# EAGLE design led_stripe_pwm (EAGLE 6.6.0)
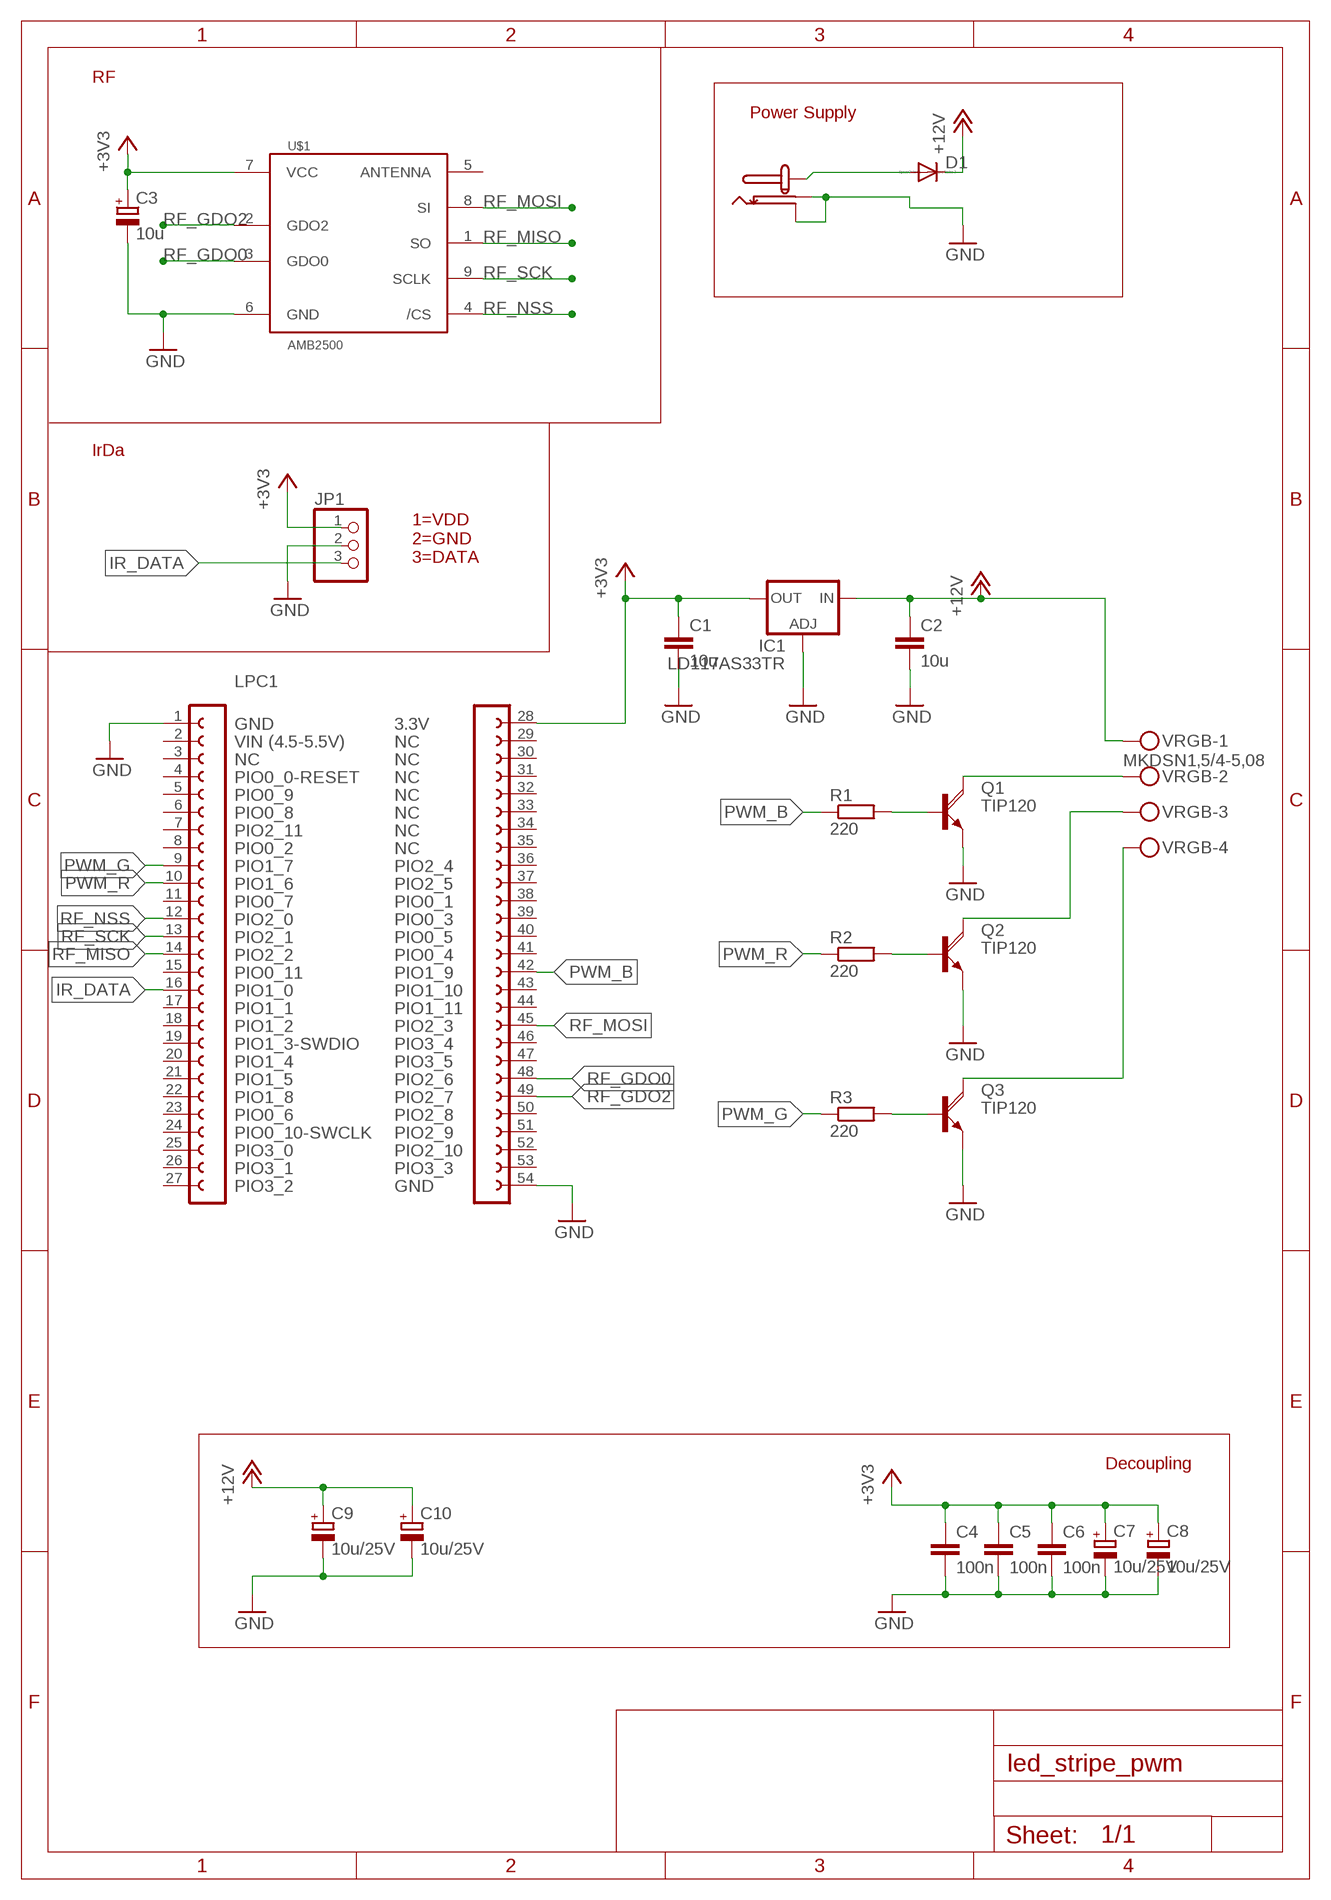
[diagram p0: schematic, sheet 1]

## Parts
C1  10u  C-EUC0805K  [C0805K]
C2  10u  C-EUC0805K  [C0805K]
C3  10u  CPOL-EUA/3216-18W  [A/3216-18W]
C4  100n  C-EUC0805  [C0805]
C5  100n  C-EUC0805  [C0805]
C6  100n  C-EUC0805  [C0805]
C7  10u/25V  CPOL-EUB  [PANASONIC_B]
C8  10u/25V  CPOL-EUB  [PANASONIC_B]
C9  10u/25V  CPOL-EUB  [PANASONIC_B]
C10  10u/25V  CPOL-EUB  [PANASONIC_B]
D1  DIODE-DO201-15  [DO201-15]
IC1  LD117AS33TR  [SOT223]
JP1  PINHD-1X3  [1X03]
LPC1  LPCXPRESSO_LPC1114  [LPCXPRESSO_LPC1114]
Q1  TIP120  [TO220AH]
Q2  TIP120  [TO220AH]
Q3  TIP120  [TO220AH]
R1  220  R-EU_R0805  [R0805]
R2  220  R-EU_R0805  [R0805]
R3  220  R-EU_R0805  [R0805]
U$1  AMB2500  AMB8400  [AMB8400]
U$2  DC_JACK  [DC_JACK_21]
VRGB  MKDSN1,5/4-5,08  [MKDSN1,5/4-5,08]

## Nets
+3V3: C1.1 C3.+ C4.1 C5.1 C6.1 C7.+ C8.+ IC1.4(OUT) JP1.1 LPC1.28 U$1.7(VCC)
+12V: C2.1 C9.+ C10.+ D1.C IC1.3(IN) VRGB.1
GND: C1.2 C2.2 C3.- C4.2 C5.2 C6.2 C7.- C8.- C9.- C10.- IC1.1(ADJ) JP1.2 LPC1.1 LPC1.54 Q1.E Q2.E Q3.E U$1.6(GND) U$2.P$2 U$2.P$3
IR_DATA: JP1.3 LPC1.16
N$1: Q1.B R1.2
N$2: Q2.B R2.2
N$3: Q3.B R3.2
N$4: Q2.C VRGB.3
N$5: Q1.C VRGB.2
N$6: Q3.C VRGB.4
N$7: D1.A U$2.P$1
PWM_B: LPC1.42 R1.1
PWM_G: LPC1.9 R3.1
PWM_R: LPC1.10 R2.1
RF_GDO0: LPC1.48 U$1.3(GDO0)
RF_GDO2: LPC1.49 U$1.2(GDO2)
RF_MISO: LPC1.14 U$1.1(SO)
RF_MOSI: LPC1.45 U$1.8(SI)
RF_NSS: LPC1.12 U$1.4(/CS)
RF_SCK: LPC1.13 U$1.9(SCLK)
Unconnected: LPC1.2 LPC1.3 LPC1.4 LPC1.5 LPC1.6 LPC1.7 LPC1.8 LPC1.11 LPC1.15 LPC1.17 LPC1.18 LPC1.19 LPC1.20 LPC1.21 LPC1.22 LPC1.23 LPC1.24 LPC1.25 LPC1.26 LPC1.27 LPC1.29 LPC1.30 LPC1.31 LPC1.32 LPC1.33 LPC1.34 LPC1.35 LPC1.36 LPC1.37 LPC1.38 LPC1.39 LPC1.40 LPC1.41 LPC1.43 LPC1.44 LPC1.46 LPC1.47 LPC1.50 LPC1.51 LPC1.52 LPC1.53 U$1.5(ANTENNA)

## Notes on the sheet
- RF
- Power Supply
- IrDa
- 1=VDD
  2=GND
  3=DATA
- Decoupling

## Library data of the parts
C1 C2 C4-C6 = rcl:C-EU: CAPACITOR, European symbol
C3 C7-C10 = rcl:CPOL-EU: POLARIZED CAPACITOR, European symbol
D1 = diode:DIODE-: DIODE
IC1 = v-reg:LD117A?*: Low drop fixed and adjustable positive voltage regulators 1 A Source: http://www.st.com/stonline/products/literature/ds/7194/ld1117axx.pdf
JP1 = pinhead:PINHD-1X3: PIN HEADER
LPC1 = LPCXpresso_boards:LPCXPRESSO_LPC1114
Q1-Q3 = transistor-power:TIP120: NPN DARLINGTON TRANSISTOR
R1-R3 = rcl:R-EU_: RESISTOR, European symbol
U$1 = Amber-Wireless:AMB8400
U$2 = DC_Jack_Cliff_FC681465P:DC_JACK
VRGB = con-phoenix-508:MKDSN1,5/4-5,08: MKDSN 1,5/ 4-5,08 Printklemme Nennstrom: 13,5 A Nennspannung: 250 V Rastermaß: 5,08 mm Polzahl: 4 Anschlussart: Schraubanschluss Montage: Löten Anschlussrichtung Leiter/Platine: 0 ° Artikelnummer: 1729144 Source: http://eshop.phoenixcontact.com .. 1729144.pdf

## Board
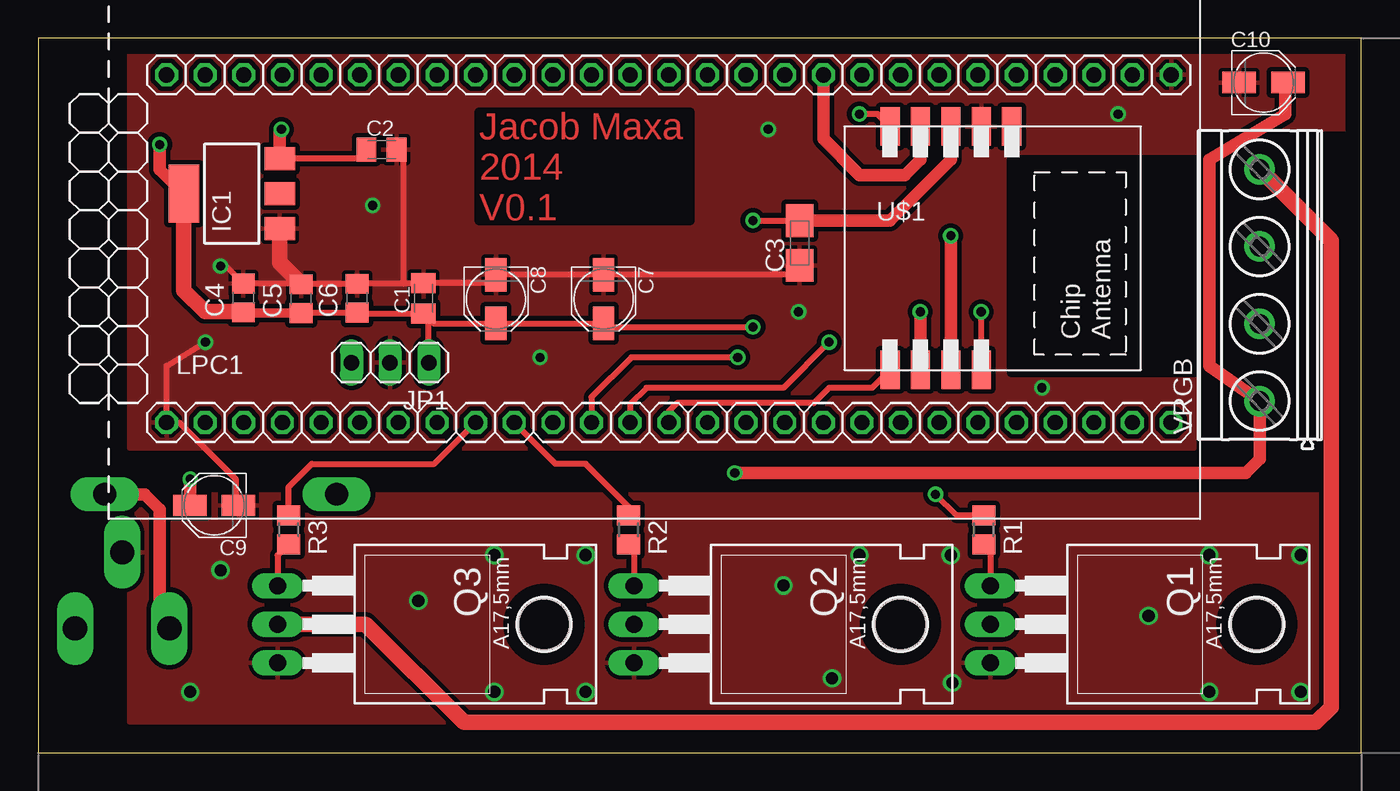
[diagram p1: board, top side]
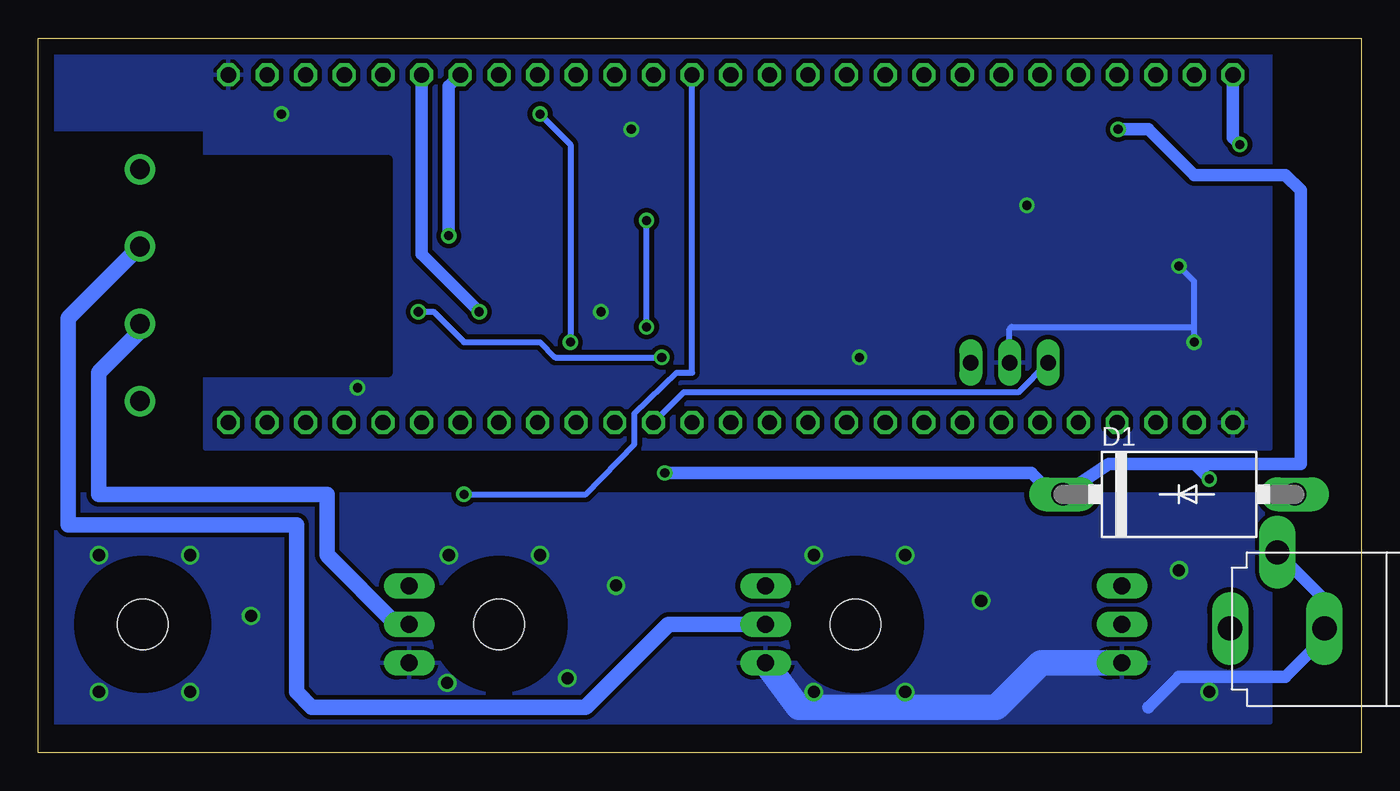
[diagram p2: board, bottom side, seen from below]

Size 87 x 47 mm. Coordinates in mm from the lower left corner, seen from the top.
Outline: 0,0 87,0 87,47 0,47 0,0
Copper layers (1*16): Top 0.035mm / dielectric 1.5mm / Bottom 0.035mm
Design rules "default": minimum track width 10mil, minimum drill 24mil, track to track 8mil, track to pad 8mil, pad to pad 8mil, via to via 8mil, smd to smd 8mil, copper to edge 40mil, drill to drill 8mil, minimum pad ring 10mil, minimum via ring 8mil, stop-mask expansion 4mil, vias tented up to drill 0mil, thermal gap 10mil
tRestrict: area 64,25 to 73,39; area 73,25 to 76,39
bRestrict: area 64,25 to 73,39; area 73,25 to 76,39

### Footprints (pad centres in the part's own frame; a part is rotated, then mirrored left to right if it is on the bottom)
C0805K = smd 1.3 x 1.6: 1 -1,0; 2 1,0
A/3216-18W = smd 2.15 x 1.8: + 1.475,0; - -1.475,0
C0805 = smd 1.3 x 1.5: 1 -0.95,0; 2 0.95,0
PANASONIC_B = smd 2.2 x 1.4: + 1.6,0; - -1.6,0
DO201-15 = drill 1.499 long: A 7.62,0; C -7.62,0
SOT223 = smd 1.5 x 2: 1 -2.3,-3.15; 2 0,-3.15; 3 2.3,-3.15 | smd 3.8 x 2: 4 0,3.15
1X03 = drill 1.016 long: 1 -2.54,0; 2 0,0; 3 2.54,0
LPCXPRESSO_LPC1114 = drill 1 octagon: 1 33.655,-5.715; 2 36.195,-5.715; 3 38.735,-5.715; 4 41.275,-5.715; 5 43.815,-5.715; 6 46.355,-5.715; 7 48.895,-5.715; 8 51.435,-5.715; 9 53.975,-5.715; 10 56.515,-5.715; 11 59.055,-5.715; 12 61.595,-5.715; 13 64.135,-5.715; 14 66.675,-5.715; 15 69.215,-5.715; 16 71.755,-5.715; 17 74.295,-5.715; 18 76.835,-5.715; 19 79.375,-5.715; 20 81.915,-5.715; 21 84.455,-5.715; 22 86.995,-5.715; 23 89.535,-5.715; 24 92.075,-5.715; 25 94.615,-5.715; 26 97.155,-5.715; 27 99.695,-5.715; 28 33.655,17.145; 29 36.195,17.145; 30 38.735,17.145; 31 41.275,17.145; 32 43.815,17.145; 33 46.355,17.145; 34 48.895,17.145; 35 51.435,17.145; 36 53.975,17.145; 37 56.515,17.145; 38 59.055,17.145; 39 61.595,17.145; 40 64.135,17.145; 41 66.675,17.145; 42 69.215,17.145; 43 71.755,17.145; 44 74.295,17.145; 45 76.835,17.145; 46 79.375,17.145; 47 81.915,17.145; 48 84.455,17.145; 49 86.995,17.145; 50 89.535,17.145; 51 92.075,17.145; 52 94.615,17.145; 53 97.155,17.145; 54 99.695,17.145
TO220AH = drill 1.118 long: B -2.54,-6.35; C 0,-6.35; E 2.54,-6.35 | hole 3.302: 0,11.176
R0805 = smd 1.3 x 1.5: 1 -0.95,0; 2 0.95,0
AMB8400 = smd 1.27 x 2.54: 1 -1.77,-8; 2 0.23,-8; 3 2.23,-8; 4 4.23,-8; 5 6.23,8; 6 4.23,8; 7 2.23,8; 8 0.23,8; 9 -1.77,8
DC_JACK_21 = drill 1.6 long: P$1 0.02,-0.08; P$2 -3.08,-5.08; P$3 -6.18,-0.08
MKDSN1,5/4-5,08 = drill 1.3 pad 2: 1 -7.641,0.025; 2 -2.561,0.025; 3 2.519,0.025; 4 7.599,0.025

### Placement (x,y rotation side)
C1  25.34,29.89 90 top
C2  22.58,39.66 0 top
C3  50.07,33.52 90 top
C4  13.5,29.91 90 top
C5  17.3,29.86 90 top
C6  20.97,29.89 90 top
C7  37.18,29.83 270 top
C8  30.1,29.83 270 top
C9  11.58,16.27 180 top
C10  80.56,44.07 0 top
D1  12,17 0 bottom
IC1  12.74,36.77 90 top
JP1  23.14,25.66 180 top
LPC1  -25.21,27.43 0 top
Q1  68.95,8.45 270 top
Q2  45.52,8.45 270 top
Q3  22.09,8.45 270 top
R1  62.17,14.66 270 top
R2  38.82,14.66 270 top
R3  16.47,14.66 270 top
U$1  57.78,33.18 0 top
U$2  8.61,8.1 180 bottom
VRGB  80.33,30.77 90 top

### Tracks (layer width: path | path; a pad name or v marks a point on that pad's centre or on a via)
+3V3  (via drill 0.6)
  Top 0.406: C5.1 17.33,28.94 C6.1 21.02,28.89 C1.1 | C1.1 26,28.23 C8.+ C7.+ 37.41,28 v47,28 | v47,35 v47.01,34.99 C3.+ | JP1.1 25.68,28.55 C1.1
  Top 0.61: C4.1 13.55,28.91 C5.1
  Top 0.813: C3.+ 56,35 60,39 60,41 60.01,41.01 U$1.7 | IC1.4 8,38.36 v8,40
  Top 1.016: IC1.4 9.59,30.41 11,29 13.46,29 C4.1
  Bottom 0.406: v47,28 v47,35
  Bottom 0.813: v8,40 8.45,40.45 LPC1.28
+12V  (via drill 0.6)
  Top 0.406: C2.1 20.99,39.07 IC1.3 | C10.+ 82,43.91 82,42
  Top 0.813: 82,44 82,42 77,39 77,25.43 VRGB.1 80.31,19.3 79.4,18.4 v45.8,18.4 | C9.+ 10,16.29 v10,18 | v16,41 15.89,40.89 IC1.3
  Bottom 0.813: v10,18 11,19 | v45.8,18.4 21.7,18.4 20.3,17 D1.C 16.62,19 11,19 | 11,19 4,19 4,37 5,38 11,38 14,41 v16,41
GND  (via drill 0.6, 0.8)
  Top 0.406: C3.- 49.45,31.43 C7.- C8.- 29.56,30.89 C1.2 25.29,30.84 24,30.84 | 24,30.84 C6.2 20.94,30.81 C5.2 17.25,30.86 C4.2 12.36,32 v12,32 | C2.2 24,39.24 24,30.84 | v11,27 8.45,25.45 LPC1.1 9.29,21.71 13,18 13,16.45 C9.- | C10.- 78.45,44.58
  Top 1.016: IC1.1 15.89,32.22 C5.2
  Bottom 0.406: v11,27 11,28 | 11,28 11,31 v12,32 | JP1.2 23.14,27.86 23,28 11,28
  Bottom 0.813: 14,3 12,5 5,5 2.43,7.57 U$2.P$3 2.43,10.08 U$2.P$2
  Bottom 1.676: Q3.E 21.09,5.91 24,3 37,3 Q2.E
  other vias: 71,42 66,24 48,41 50,29 33,26 22,36 30,13 36,13 30,4 36,4 54,13 60,13 60.1,4.6 52.2,4.9 77,4 77,13 83,13 83,4 73,9 49,11 25,10 12,12 10,4
  pour Bottom (isolate 0.305): 6,46 86,46 86,41 76,41 76,20 6,20
  pour Top (isolate 0.305): 6,46 86,46 86,41 76,41 76,20 6,20
  pour Bottom (isolate 0.305): 6,2 86,2 86,17 6,17
  pour Top (isolate 0.305): 6,2 86,2 86,17 6,17
IR_DATA
  Bottom 0.406: JP1.3 22.56,23.7 44.56,23.7 LPC1.16
N$1
  Top 0.406: R1.2 62.6,13.71 Q1.B
N$2
  Top 0.406: R2.2 39.17,13.71 Q2.B
N$3
  Top 0.406: R3.2 15.74,12.98 Q3.B
N$4
  Bottom 1.016: VRGB.3 85,28.59 85,15 70,15 70,4 69,3 51,3 45.55,8.45 Q2.C
N$5
  Bottom 1.016: VRGB.2 80.31,27.7 83,25 83,17 68,17 68,13 63.45,8.45 Q1.C
N$6
  Top 1.016: VRGB.4 85,33.67 85,3 84,2 28,2 21.55,8.45 Q3.C
N$7
  Top 0.813: D1.A 7,17 8,16 8,8.81 U$2.P$1
PWM_B  (via drill 0.6)
  Top 0.406: R1.1 60.39,15.61 v59,17
  Bottom 0.406: v59,17 51,17 47.8,20.3 47.8,22.3 45,25 44,25 LPC1.42
PWM_G
  Top 0.406: R3.1 16.47,17.47 18,19 26.05,19 LPC1.9
PWM_R
  Top 0.406: R2.1 38.82,16.18 36,19 34.02,19 LPC1.10
RF_GDO0  (via drill 0.6)
  Top 0.813: U$1.3 v60.01,33.99 v60,34
  Bottom 0.813: v60,34 60,43.82 LPC1.48
RF_GDO2  (via drill 0.6)
  Top 0.813: v58,29 U$1.2
  Bottom 0.813: LPC1.49 61.78,32.78 v58,29
RF_MISO
  Top 0.406: U$1.1 54.83,24 52,24 51,23 42,23 41.47,22.46 LPC1.14
RF_MOSI
  Top 0.813: LPC1.45 51.62,40.38 54,38 57,38 58.01,39.01 U$1.8
RF_NSS  (via drill 0.6)
  Top 0.406: U$1.4 v62.01,28.99 v62,29 | v46,26 39,26 36.38,23.39 LPC1.12
  Bottom 0.406: v62,29 61,29 59,27 54,27 53,26 v46,26
RF_SCK  (via drill 0.6)
  Top 0.406: U$1.9 55.19,42 v54,42 | v52,27 49,24 40,24 38.92,22.93 LPC1.13
  Bottom 0.406: v54,42 52,40 v52,27

### Text on the board
Top: Jacob Maxa / 2014 / V0.1